# Altium schematic sheet SATA_crossover.schdoc
size A4; CompanyName: Technische Hochschule Nürnberg Georg Simon Ohm; Organization: UltraZohm; Address1: Kesslerplatz 12; Address2: 90489 Nürnberg; Address3: GERMANY; SheetNumber: 35; SheetTotal: 36; Website: www.ultrazohm.com
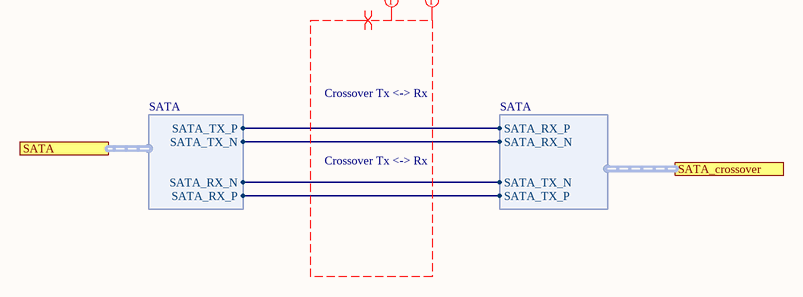
[diagram p0: SATA_crossover.schdoc]

## Ports
SATA (harness SATA), SATA_crossover (harness SATA)

## Harnesses
SATA: SATA_TX_P, SATA_TX_N, SATA_RX_N, SATA_RX_P
SATA: SATA_RX_N, SATA_RX_P, SATA_TX_N, SATA_TX_P

## Nets
(unnamed): port SATA.SATA_TX_P, port SATA_crossover.SATA_RX_P
(unnamed): port SATA.SATA_TX_N, port SATA_crossover.SATA_RX_N
(unnamed): port SATA.SATA_RX_N, port SATA_crossover.SATA_TX_N
(unnamed): port SATA.SATA_RX_P, port SATA_crossover.SATA_TX_P

## Layout directives
differential pair: (no net found under the mark)
net class HS: (no net found under the mark)
net class SATA: (no net found under the mark)

## Notes on the sheet
- Crossover Tx <-> Rx
- Title
- Revision:
- Design Engineer:
- Date:
- Project:
- Sheet
- of